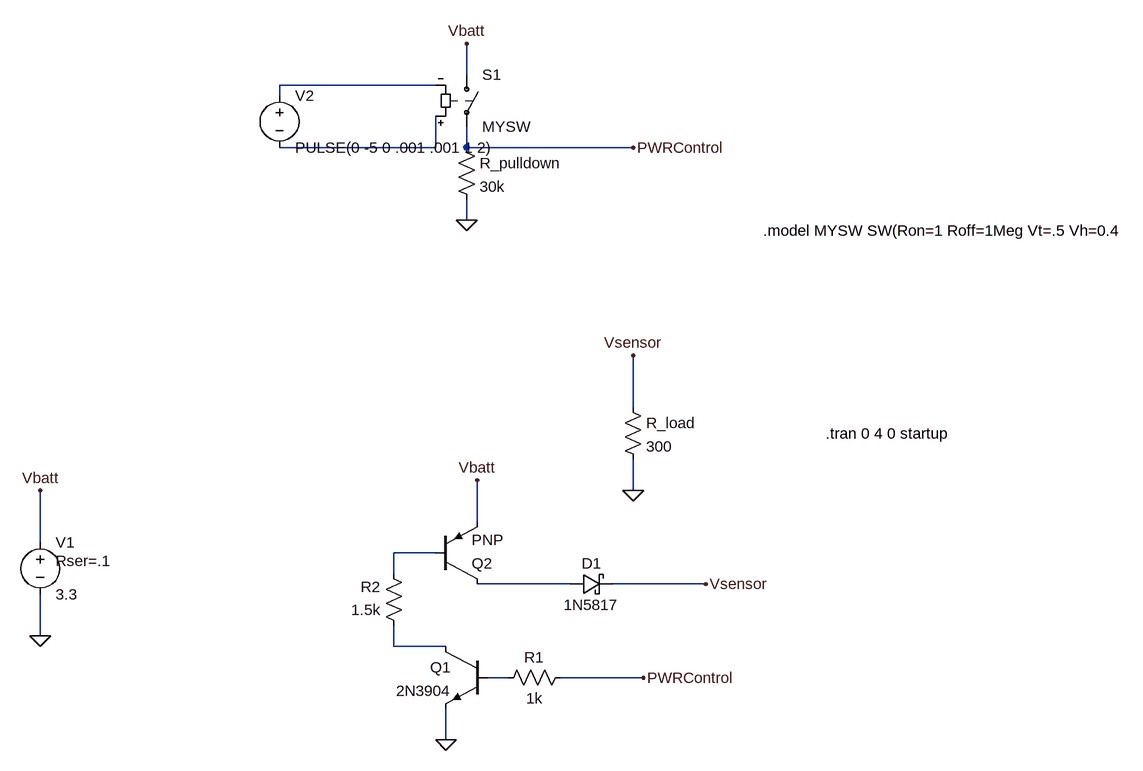
[diagram p0: schematic Draft1.asc]
Draft1.asc, the LTspice schematic file:
Version 4
SHEET 1 1244 680
WIRE 192 -928 192 -976
WIRE 144 -912 -96 -912
WIRE -96 -896 -96 -912
WIRE 144 -816 144 -864
WIRE 144 -816 -96 -816
WIRE 192 -816 192 -848
WIRE 448 -816 192 -816
WIRE 192 -704 192 -736
WIRE 448 -416 448 -496
WIRE 448 -288 448 -336
WIRE 208 -240 208 -304
WIRE -464 -208 -464 -288
WIRE 144 -192 80 -192
WIRE 80 -160 80 -192
WIRE 352 -144 208 -144
WIRE 560 -144 416 -144
WIRE -464 -64 -464 -128
WIRE 80 -48 80 -80
WIRE 160 -48 80 -48
WIRE 256 0 224 0
WIRE 464 0 336 0
WIRE 160 96 160 48
FLAG 160 96 0
FLAG 208 -304 Vbatt
FLAG 560 -144 Vsensor
FLAG 464 0 PWRControl
FLAG -464 -288 Vbatt
FLAG -464 -64 0
FLAG 448 -288 0
FLAG 448 -496 Vsensor
FLAG 192 -704 0
FLAG 448 -816 PWRControl
FLAG 192 -976 Vbatt
SYMBOL npn 224 -48 M0
SYMATTR InstName Q1
SYMATTR Value 2N3904
SYMBOL res 352 -16 R90
WINDOW 0 0 56 VBottom 2
WINDOW 3 32 56 VTop 2
SYMATTR InstName R1
SYMATTR Value 1k
SYMATTR SpiceLine tol=5
SYMBOL res 96 -64 R180
WINDOW 0 36 76 Left 2
WINDOW 3 36 40 Left 2
SYMATTR InstName R2
SYMATTR Value 1.5k
SYMATTR SpiceLine tol=5
SYMBOL voltage -464 -224 R0
WINDOW 123 0 0 Left 0
WINDOW 39 24 44 Left 2
SYMATTR InstName V1
SYMATTR Value 3.3
SYMATTR SpiceLine Rser=.1
SYMBOL res 432 -432 R0
SYMATTR InstName R_load
SYMATTR Value 300
SYMATTR SpiceLine tol=5
SYMBOL sw 192 -944 R0
SYMATTR InstName S1
SYMATTR Value MYSW
SYMBOL res 176 -832 R0
SYMATTR InstName R_pulldown
SYMATTR Value 30k
SYMBOL voltage -96 -912 R0
WINDOW 123 0 0 Left 0
WINDOW 39 0 0 Left 0
SYMATTR InstName V2
SYMATTR Value PULSE(0 -5 0 .001 .001 1 2)
SYMBOL pnp 144 -144 M180
SYMATTR InstName Q2
SYMBOL schottky 352 -128 R270
WINDOW 0 32 32 VTop 2
WINDOW 3 0 32 VBottom 2
SYMATTR InstName D1
SYMATTR Value 1N5817
SYMATTR Description Diode
SYMATTR Type diode
TEXT 744 -376 Left 2 !.tran 0 4 0 startup
TEXT 648 -688 Left 2 !.model MYSW SW(Ron=1 Roff=1Meg Vt=.5 Vh=0.4

The netlist it stands for:
* Draft1.asc
Q1 N005 N006 0 0 2N3904
R1 PWRControl N006 1k tol=5
R2 N005 N003 1.5k tol=5
V1 Vbatt 0 3.3 Rser=.1
R_load Vsensor 0 300 tol=5
S1 Vbatt PWRControl N002 N001 MYSW
R_pulldown PWRControl 0 30k
V2 N001 N002 PULSE(0 -5 0 .001 .001 1 2)
Q2 N004 N003 Vbatt 0 PNP
D1 N004 Vsensor 1N5817
.model D D
.lib standard.dio
.model NPN NPN
.model PNP PNP
.lib standard.bjt
.tran 0 4 0 startup
.model MYSW SW(Ron=1 Roff=1Meg Vt=.5 Vh=0.4
.backanno
.end